# EAGLE design 2021_PWR_REVD (EAGLE 9.6.2)

## Sheet 1 of 5: Template
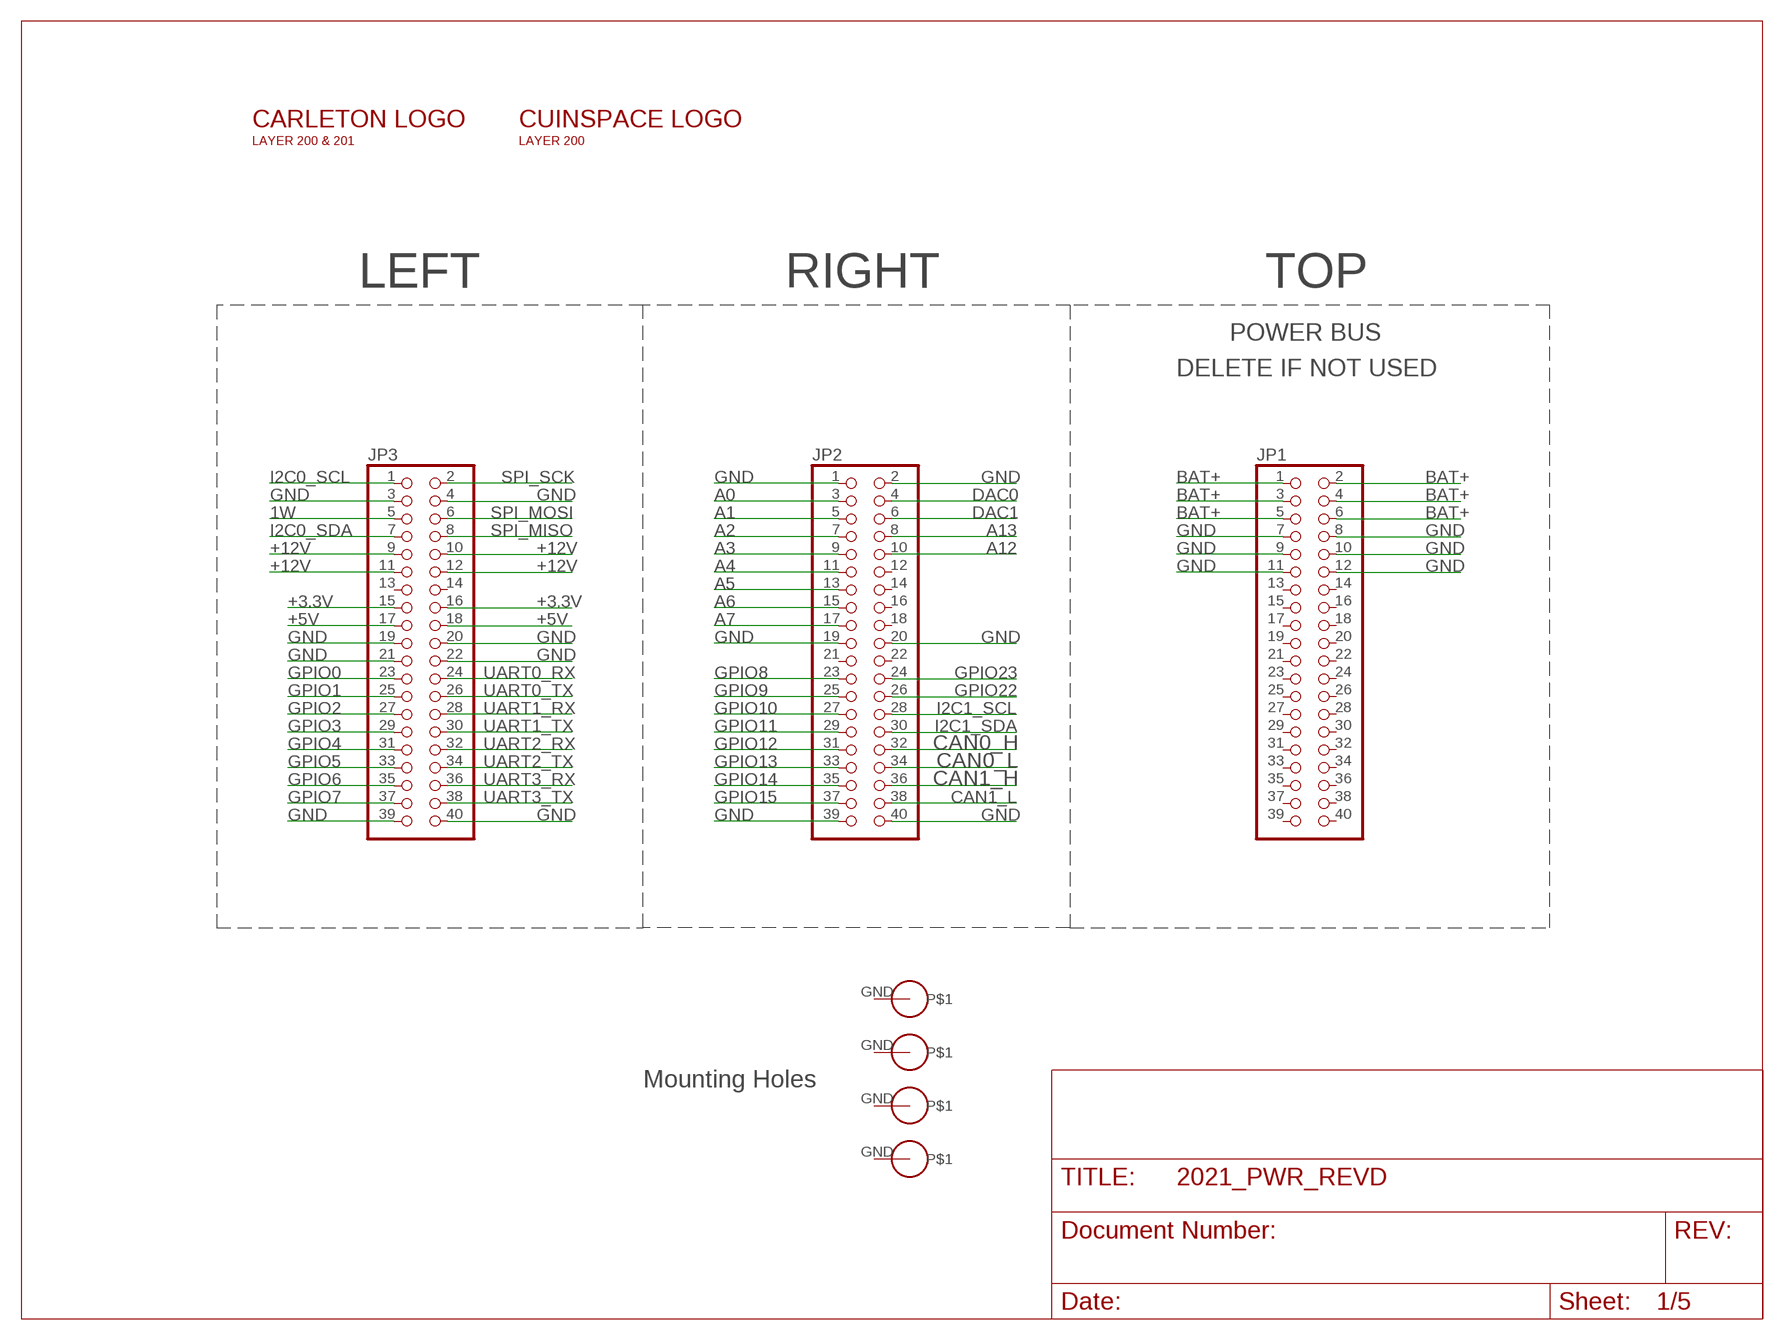
[diagram p0: schematic, sheet 1]

### Parts
$$U$1  PS/104-MOUNTING-HOLE  [PC/104-MOUNTING-HOLE]
JP1  PINHD-2X20  [2X20]
JP2  PINHD-2X20  [2X20]
JP3  PINHD-2X20  [2X20]
U$1  PS/104-MOUNTING-HOLE  [PC/104-MOUNTING-HOLE]
U$2  PS/104-MOUNTING-HOLE  [PC/104-MOUNTING-HOLE]
U$3  PS/104-MOUNTING-HOLE  [PC/104-MOUNTING-HOLE]
U$100  INSPACE3CM_L  [INSPACE_3CM_LETTERS]
U$101  CARLETON3CM  [CARLETONU_3CM]

### Nets
1W: JP3.5
+3.3V: JP3.15 JP3.16 ; also sheet 2,3
+5V: JP3.17 JP3.18 ; also sheet 2,3
+12V: JP3.9 JP3.10 JP3.11 JP3.12 ; also sheet 3
A0: JP2.3 ; also sheet 3
A1: JP2.5 ; also sheet 3
A2: JP2.7 ; also sheet 3
A3: JP2.9
A4: JP2.11
A5: JP2.13
A6: JP2.15
A7: JP2.17
A12: JP2.10
A13: JP2.8
BAT+: JP1.1 JP1.2 JP1.3 JP1.4 JP1.5 JP1.6 ; also sheet 2,3
CAN0_H: JP2.32
CAN0_L: JP2.34
CAN1_H: JP2.36
CAN1_L: JP2.38
DAC0: JP2.4
DAC1: JP2.6
GND [New Class]: JP1.7 JP1.8 JP1.9 JP1.10 JP1.11 JP1.12 JP2.1 JP2.2 JP2.19 JP2.20 JP2.39 JP2.40 JP3.3 JP3.4 JP3.19 JP3.20 JP3.21 JP3.22 JP3.39 JP3.40 ; also sheet 2,3
GPIO0: JP3.23
GPIO1: JP3.25
GPIO2: JP3.27
GPIO3: JP3.29
GPIO4: JP3.31
GPIO5: JP3.33
GPIO6: JP3.35
GPIO7: JP3.37
GPIO8: JP2.23
GPIO9: JP2.25
GPIO10: JP2.27
GPIO11: JP2.29
GPIO12: JP2.31 ; also sheet 3
GPIO13: JP2.33
GPIO14: JP2.35
GPIO15: JP2.37
GPIO22: JP2.26
GPIO23: JP2.24
I2C0_SCL: JP3.1
I2C0_SDA: JP3.7
I2C1_SCL: JP2.28
I2C1_SDA: JP2.30
SPI_MISO: JP3.8
SPI_MOSI: JP3.6
SPI_SCK: JP3.2
UART0_RX: JP3.24
UART0_TX: JP3.26
UART1_RX: JP3.28
UART1_TX: JP3.30
UART2_RX: JP3.32
UART2_TX: JP3.34
UART3_RX: JP3.36
UART3_TX: JP3.38
Unconnected: $$U$1.GND JP1.13 JP1.14 JP1.15 JP1.16 JP1.17 JP1.18 JP1.19 JP1.20 JP1.21 JP1.22 JP1.23 JP1.24 JP1.25 JP1.26 JP1.27 JP1.28 JP1.29 JP1.30 JP1.31 JP1.32 JP1.33 JP1.34 JP1.35 JP1.36 JP1.37 JP1.38 JP1.39 JP1.40 JP2.12 JP2.14 JP2.16 JP2.18 JP2.21 JP2.22 JP3.13 JP3.14 U$1.GND U$2.GND U$3.GND

### Notes on the sheet
- LEFT | RIGHT | TOP
- POWER BUS
- DELETE IF NOT USED
- Mounting Holes

## Sheet 2 of 5
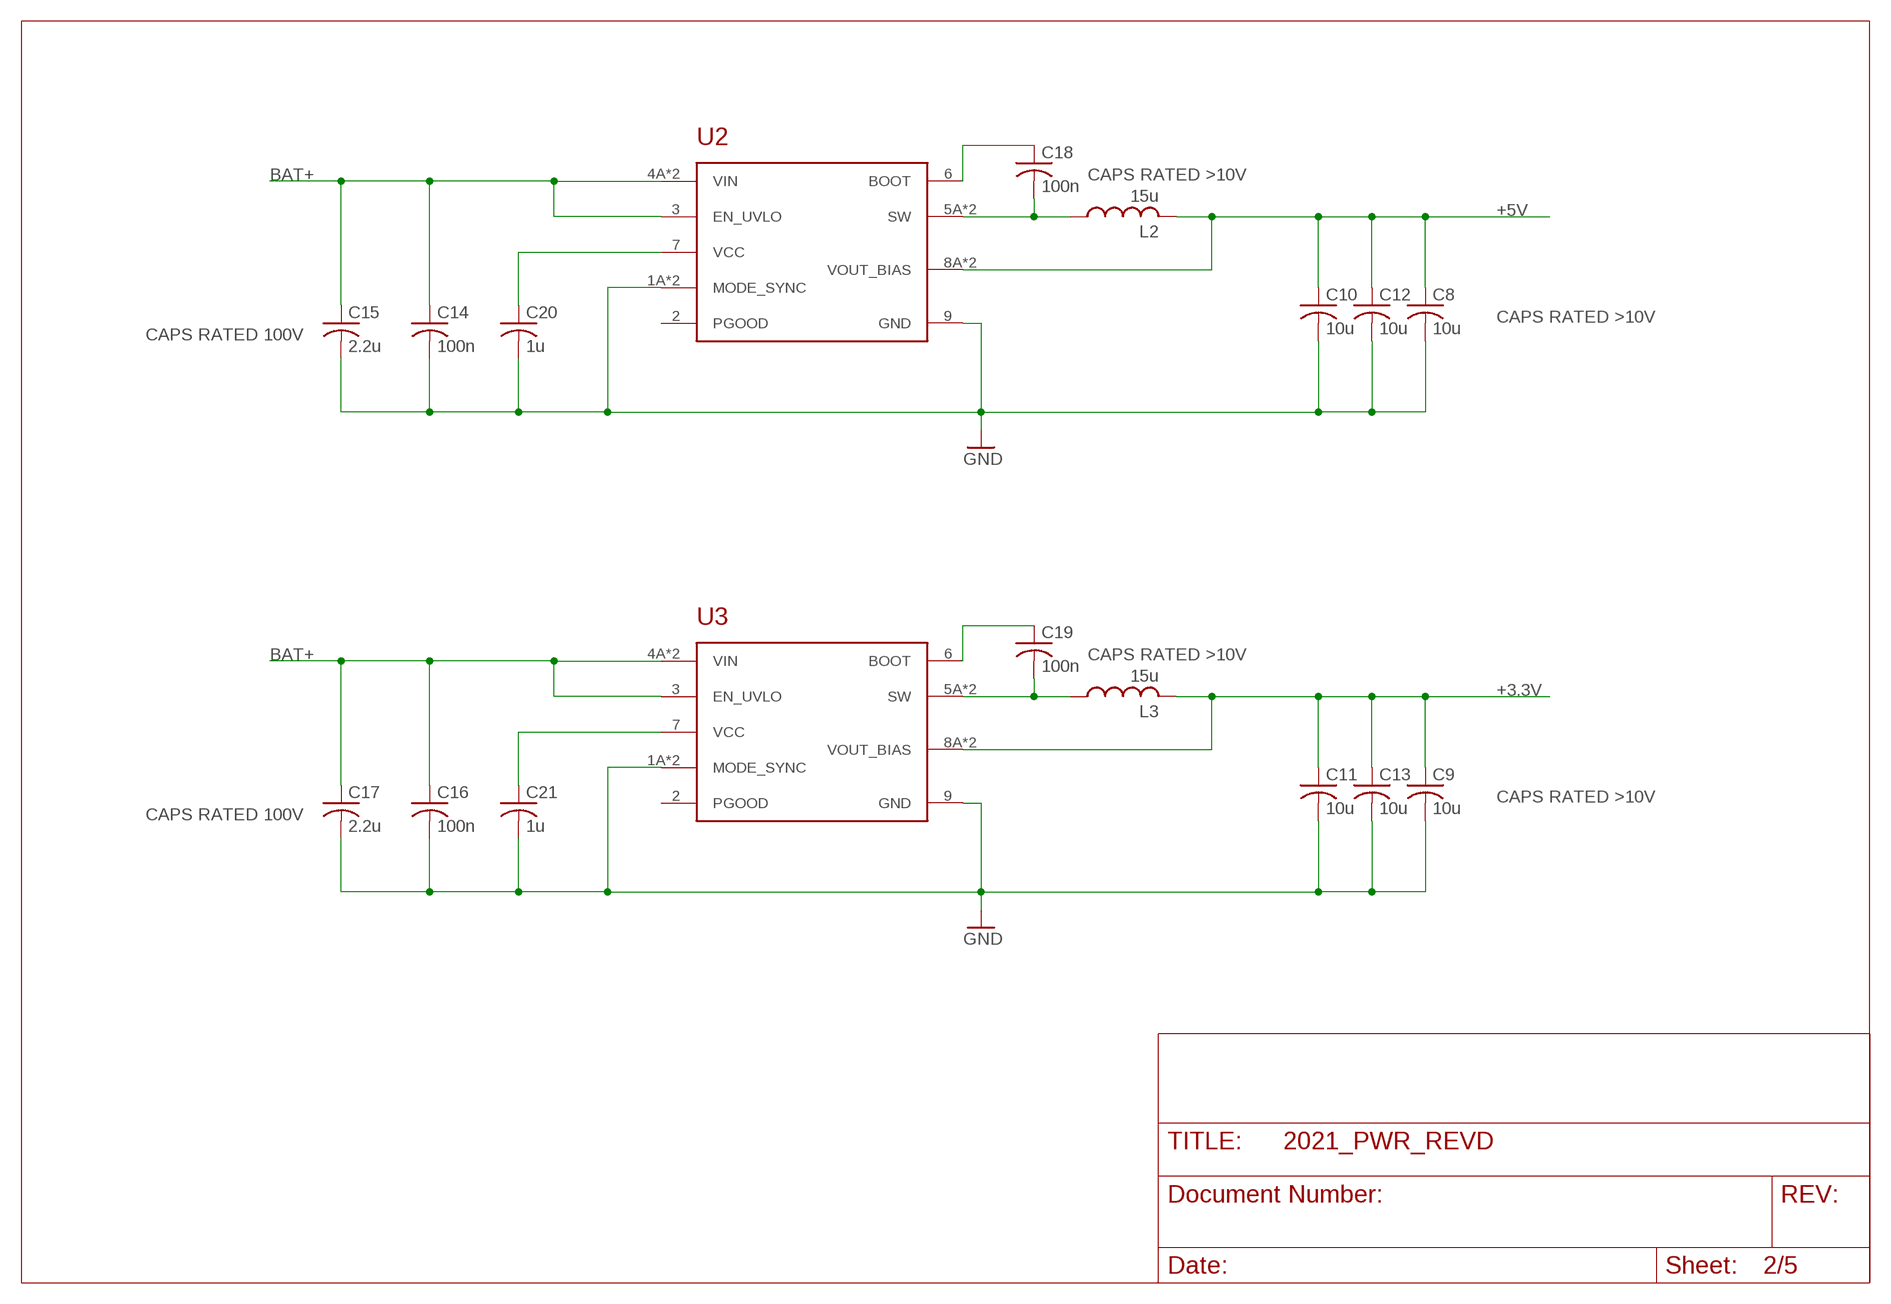
[diagram p1: schematic, sheet 2]

### Parts
C8  10u  C-USC0805  [C0805]
C9  10u  C-USC0805  [C0805]
C10  10u  C-USC0805  [C0805]
C11  10u  C-USC0805  [C0805]
C12  10u  C-USC0805  [C0805]
C13  10u  C-USC0805  [C0805]
C14  100n  C-USC0805  [C0805]
C15  2.2u  C-USC0805  [C0805]
C16  100n  C-USC0805  [C0805]
C17  2.2u  C-USC0805  [C0805]
C18  100n  C-USC0805  [C0805]
C19  100n  C-USC0805  [C0805]
C20  1u  C-USC0805  [C0805]
C21  1u  C-USC0805  [C0805]
L2  15u  IND_15UH_9A_28MOHMSRP1265A-150M  [13.5X12.5]
L3  15u  IND_15UH_9A_28MOHMSRP1265A-150M  [13.5X12.5]
U2  LMR36506LMR36506MSC3  [9-VFQFN]
U3  LMR36506LMR36506MSC3  [9-VFQFN]

### Nets
+3.3V: C9.1 C11.1 C13.1 L3.P$2 U3.8A(VOUT_BIAS) U3.8B(VOUT_BIAS) ; also sheet 1,3
+5V: C8.1 C10.1 C12.1 L2.P$2 U2.8A(VOUT_BIAS) U2.8B(VOUT_BIAS) ; also sheet 1,3
BAT+: C14.1 C15.1 C16.1 C17.1 U2.3(EN_UVLO) U2.4A(VIN) U2.4B(VIN) U3.3(EN_UVLO) U3.4A(VIN) U3.4B(VIN) ; also sheet 1,3
GND [New Class]: C8.2 C9.2 C10.2 C11.2 C12.2 C13.2 C14.2 C15.2 C16.2 C17.2 C20.2 C21.2 U2.1A(MODE_SYNC) U2.1B(MODE_SYNC) U2.9(GND) U3.1A(MODE_SYNC) U3.1B(MODE_SYNC) U3.9(GND) ; also sheet 1,3
N$3: C18.1 U2.6(BOOT)
N$4: C18.2 L2.P$1 U2.5A(SW) U2.5B(SW)
N$6: C20.1 U2.7(VCC)
N$10: C19.1 U3.6(BOOT)
N$11: C19.2 L3.P$1 U3.5A(SW) U3.5B(SW)
N$12: C21.1 U3.7(VCC)
Unconnected: U2.2(PGOOD) U3.2(PGOOD)

### Notes on the sheet
- CAPS RATED >10V
- CAPS RATED >10V
- CAPS RATED 100V
- CAPS RATED >10V
- CAPS RATED >10V
- CAPS RATED 100V

## Sheet 3 of 5
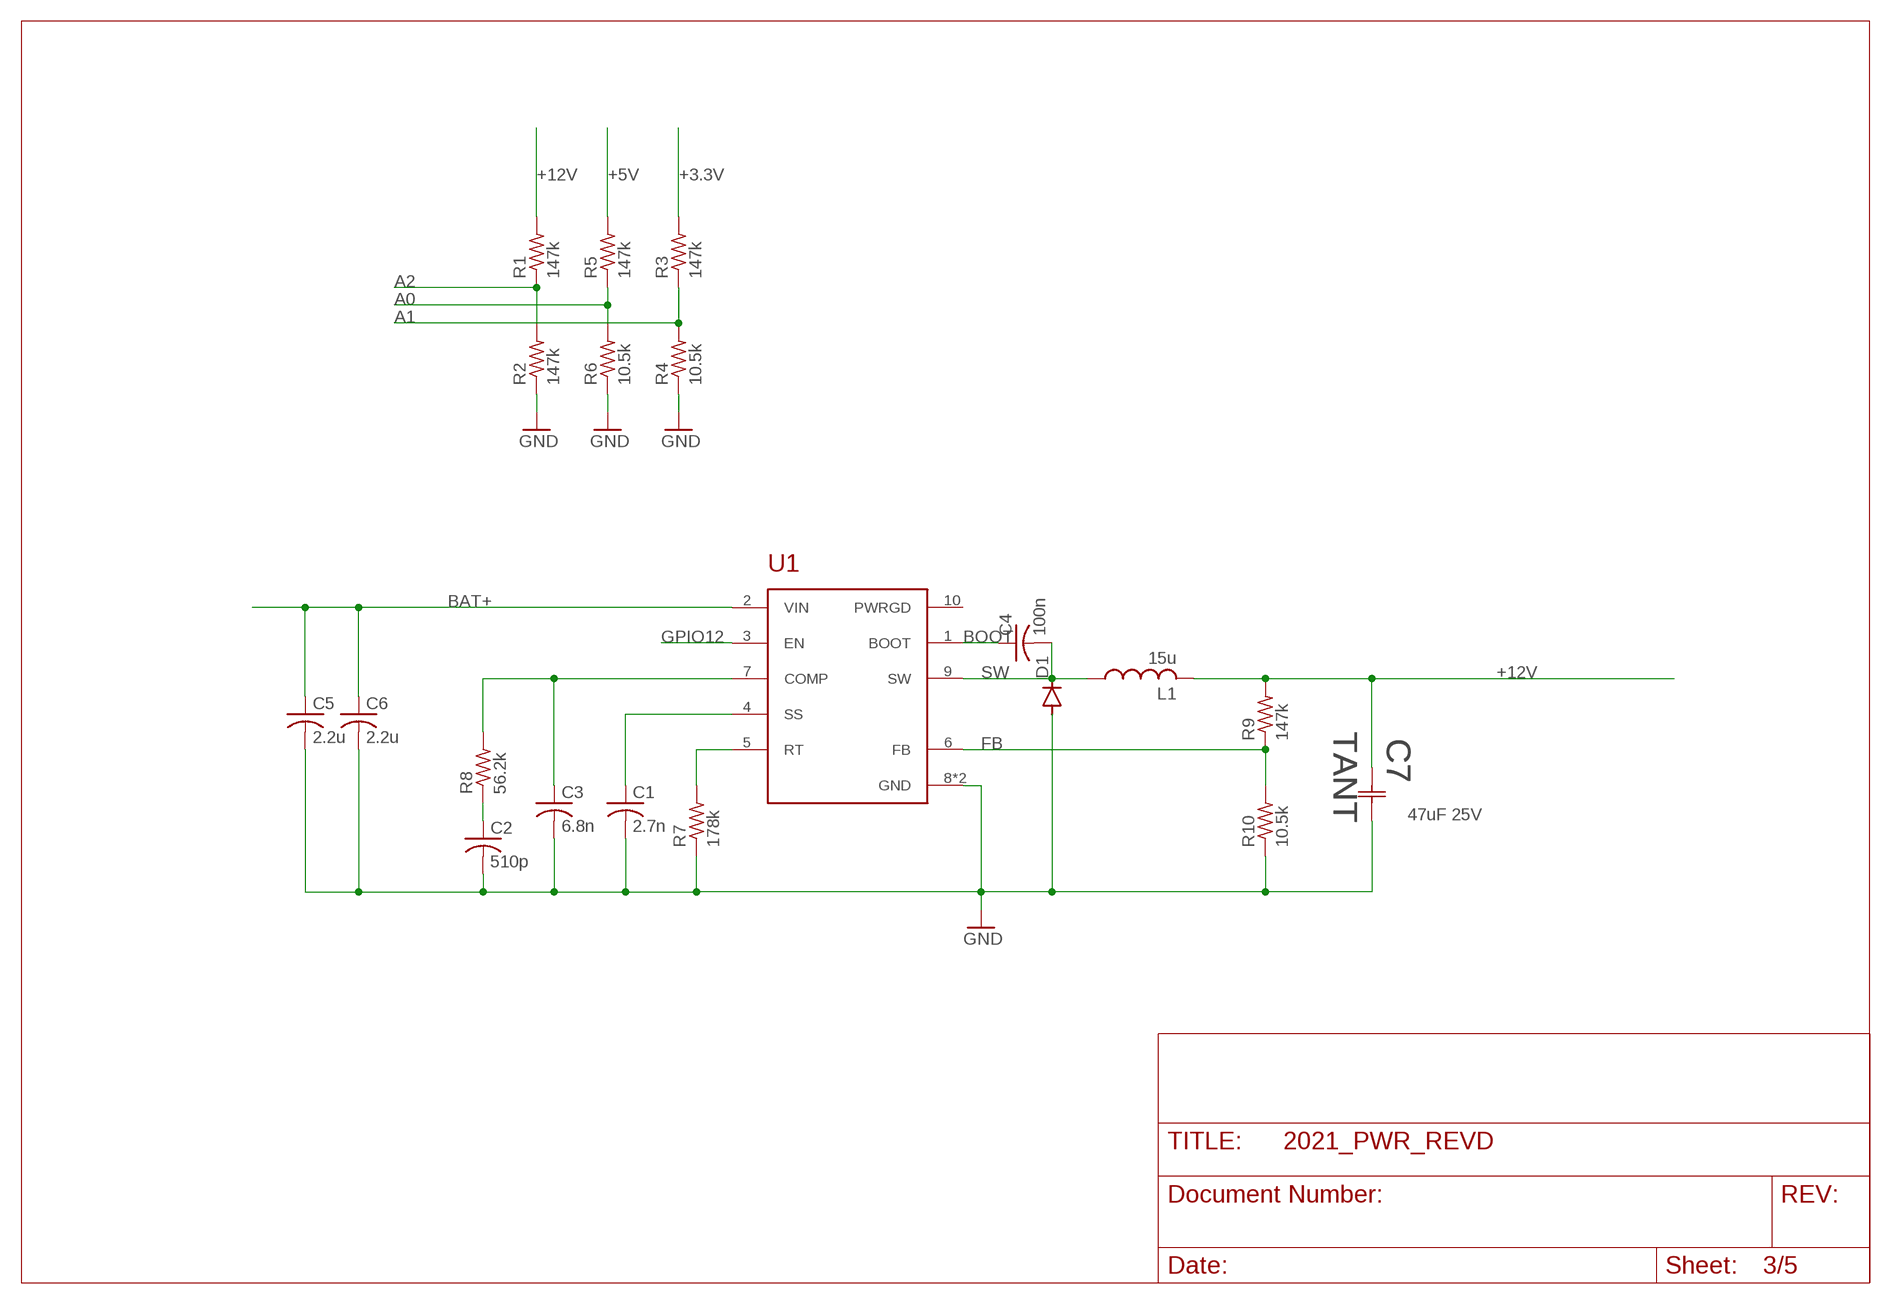
[diagram p2: schematic, sheet 3]

### Parts
C1  2.7n  C-USC0805  [C0805]
C2  510p  C-USC0805  [C0805]
C3  6.8n  C-USC0805  [C0805]
C4  100n  C-USC0805  [C0805]
C5  2.2u  C-USC0805  [C0805]
C6  2.2u  C-USC0805  [C0805]
C7  TANT  [TAJD]
D1  SCH_DIODE_10A_100VFSV10100V  [TO-277-3]
L1  15u  IND_15UH_9A_28MOHMSRP1265A-150M  [13.5X12.5]
R1  147k  R-US_R0805  [R0805]
R2  147k  R-US_R0805  [R0805]
R3  147k  R-US_R0805  [R0805]
R4  10.5k  R-US_R0805  [R0805]
R5  147k  R-US_R0805  [R0805]
R6  10.5k  R-US_R0805  [R0805]
R7  178k  R-US_R0805  [R0805]
R8  56.2k  R-US_R0805  [R0805]
R9  147k  R-US_R0805  [R0805]
R10  10.5k  R-US_R0805  [R0805]
U1  TPS54561  [10-WSON]

### Nets
+3.3V: R3.2 ; also sheet 1,2
+5V: R5.2 ; also sheet 1,2
+12V: C7.1 L1.P$2 R1.2 R9.2 ; also sheet 1
A0: R5.1 R6.2 ; also sheet 1
A1: R3.1 R4.2 ; also sheet 1
A2: R1.1 R2.2 ; also sheet 1
BAT+: C5.1 C6.1 U1.2(VIN) ; also sheet 1,2
BOOT: C4.1 U1.1(BOOT)
FB: R9.1 R10.2 U1.6(FB)
GND [New Class]: C1.2 C2.2 C3.2 C5.2 C6.2 C7.2 D1.P$2(A) D1.P$3(A) R2.1 R4.1 R6.1 R7.1 R10.1 U1.8(GND) U1.11(GND) ; also sheet 1,2
GPIO12: U1.3(EN) ; also sheet 1
N$18: R7.2 U1.5(RT)
N$19: C2.1 R8.1
N$20: C3.1 R8.2 U1.7(COMP)
N$21: C1.1 U1.4(SS)
SW: C4.2 D1.P$1(C) L1.P$1 U1.9(SW)
Unconnected: U1.10(PWRGD)

### Notes on the sheet
- 47uF 25V

## Sheet 4 of 5

## Sheet 5 of 5

## Library data of the parts
$$U$1 U$1-U$3 = CU inSpace 2019 Parts:PS/104-MOUNTING-HOLE: Mounting hole for PC/104 board.
C1-C6 C8-C21 = rcl:C-US: CAPACITOR, American symbol; SPICEPREFIX: C
C7 = CUINSPACE_Managed:TANT; MANUFACTURER_PART_NUMBER: TAJD226K016RNJ; VENDOR: AVX Corporation
D1 = PWR:SCH_DIODE_10A_100V
JP1-JP3 = pinhead:PINHD-2X20: PIN HEADER
L1-L3 = PWR:IND_15UH_9A_28MOHM
R1-R10 = rcl:R-US_: RESISTOR, American symbol; SPICEPREFIX: R
U1 = PWR:TPS54561
U2 U3 = PWR:LMR36506
U$100 = Logos:INSPACE
U$101 = Logos:CARLETON

## Net classes
2 diff pairs: width 0.254 mm

## Board
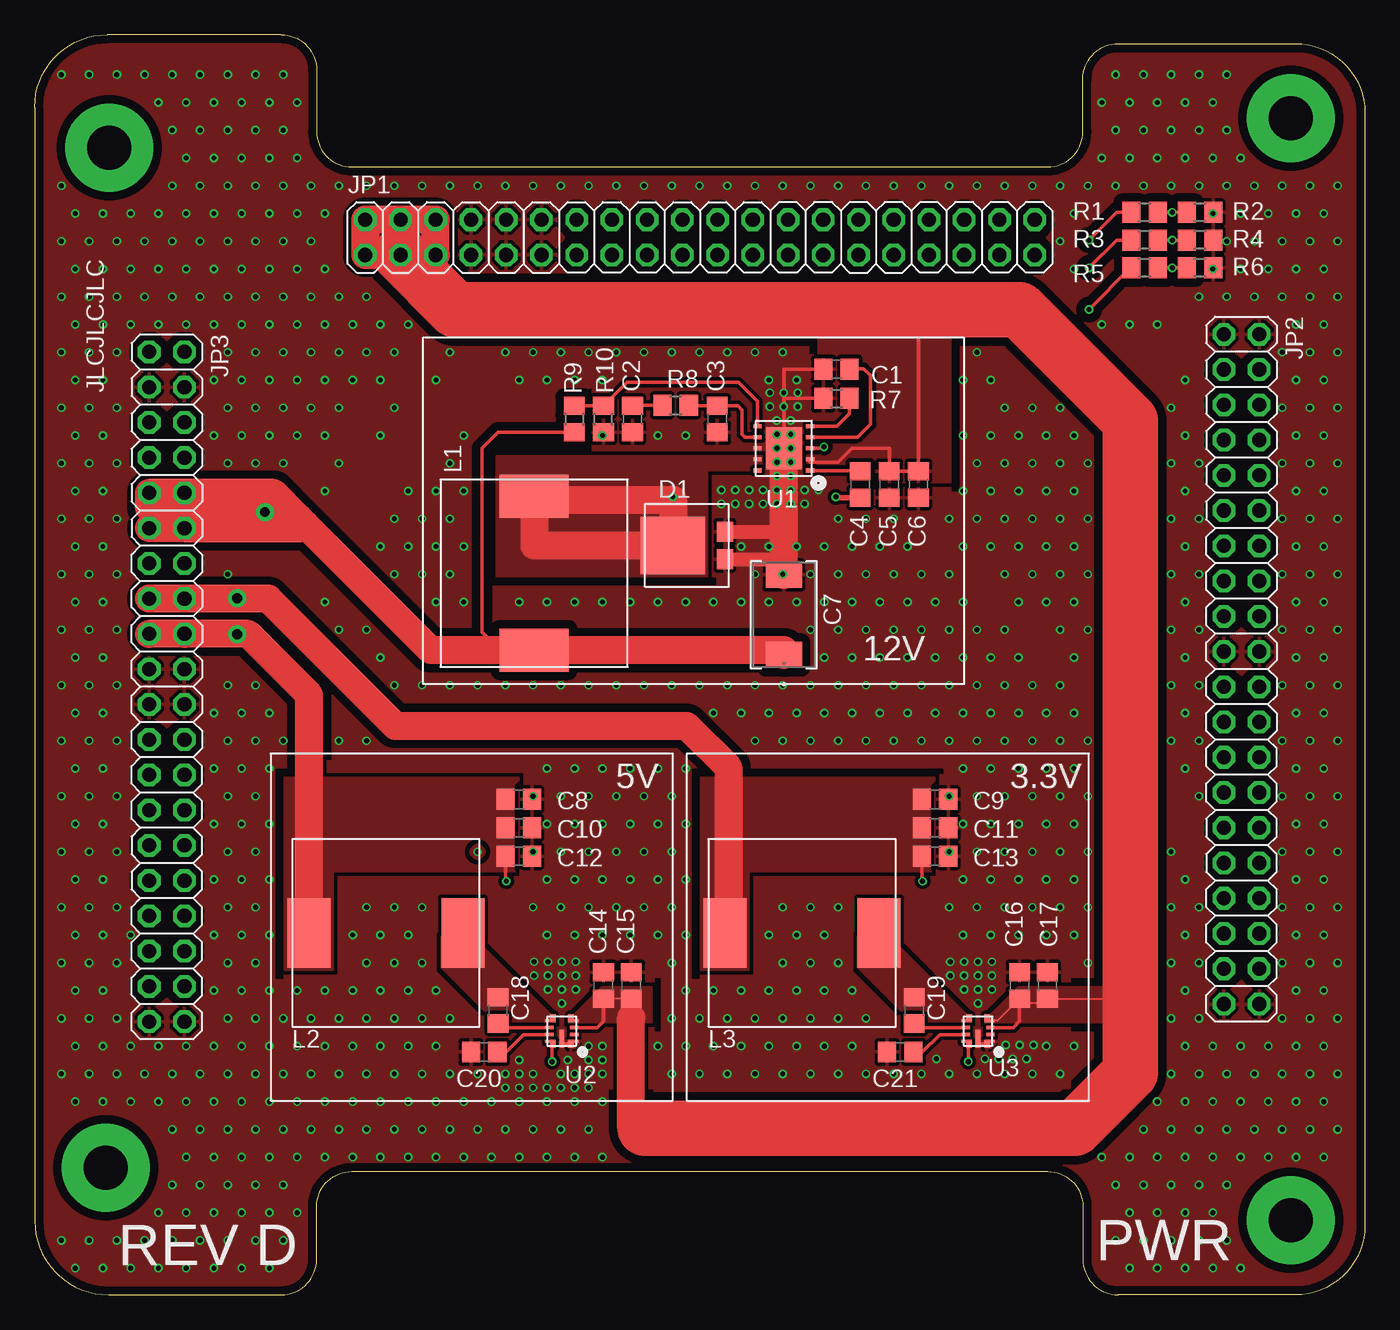
[diagram p3: board, top side]
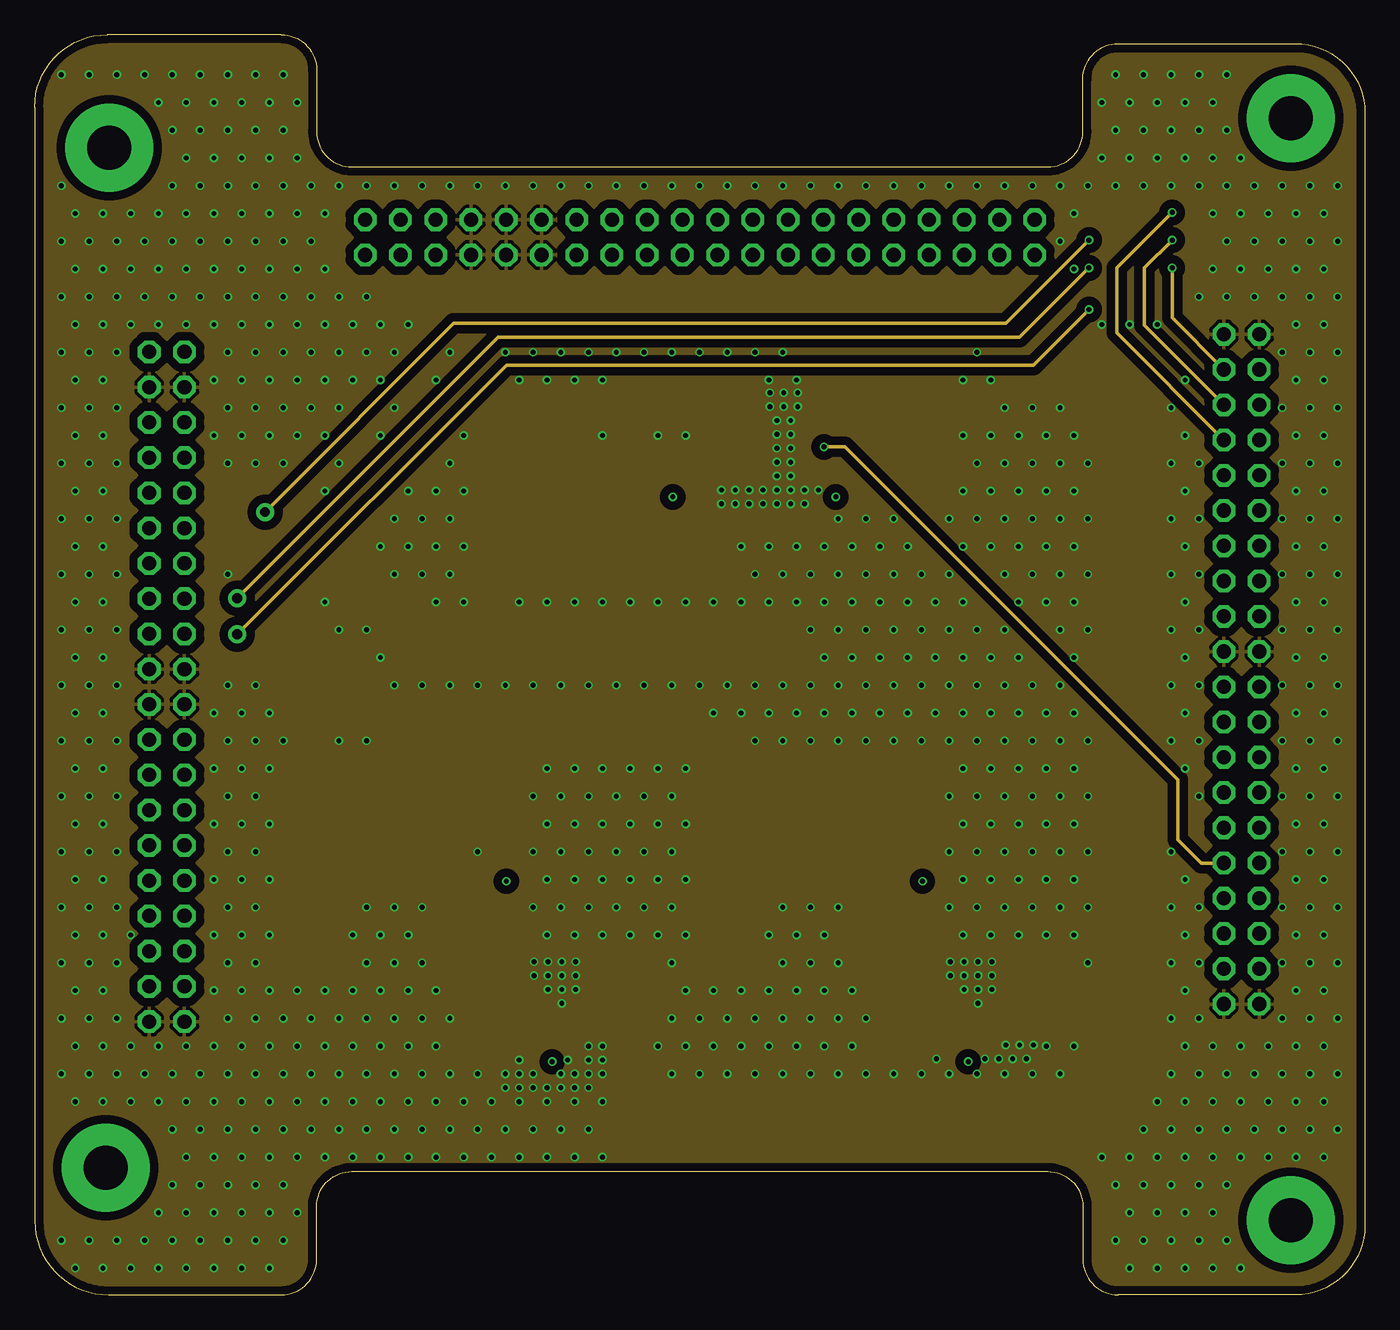
[diagram p4: board, inner layer Route2]
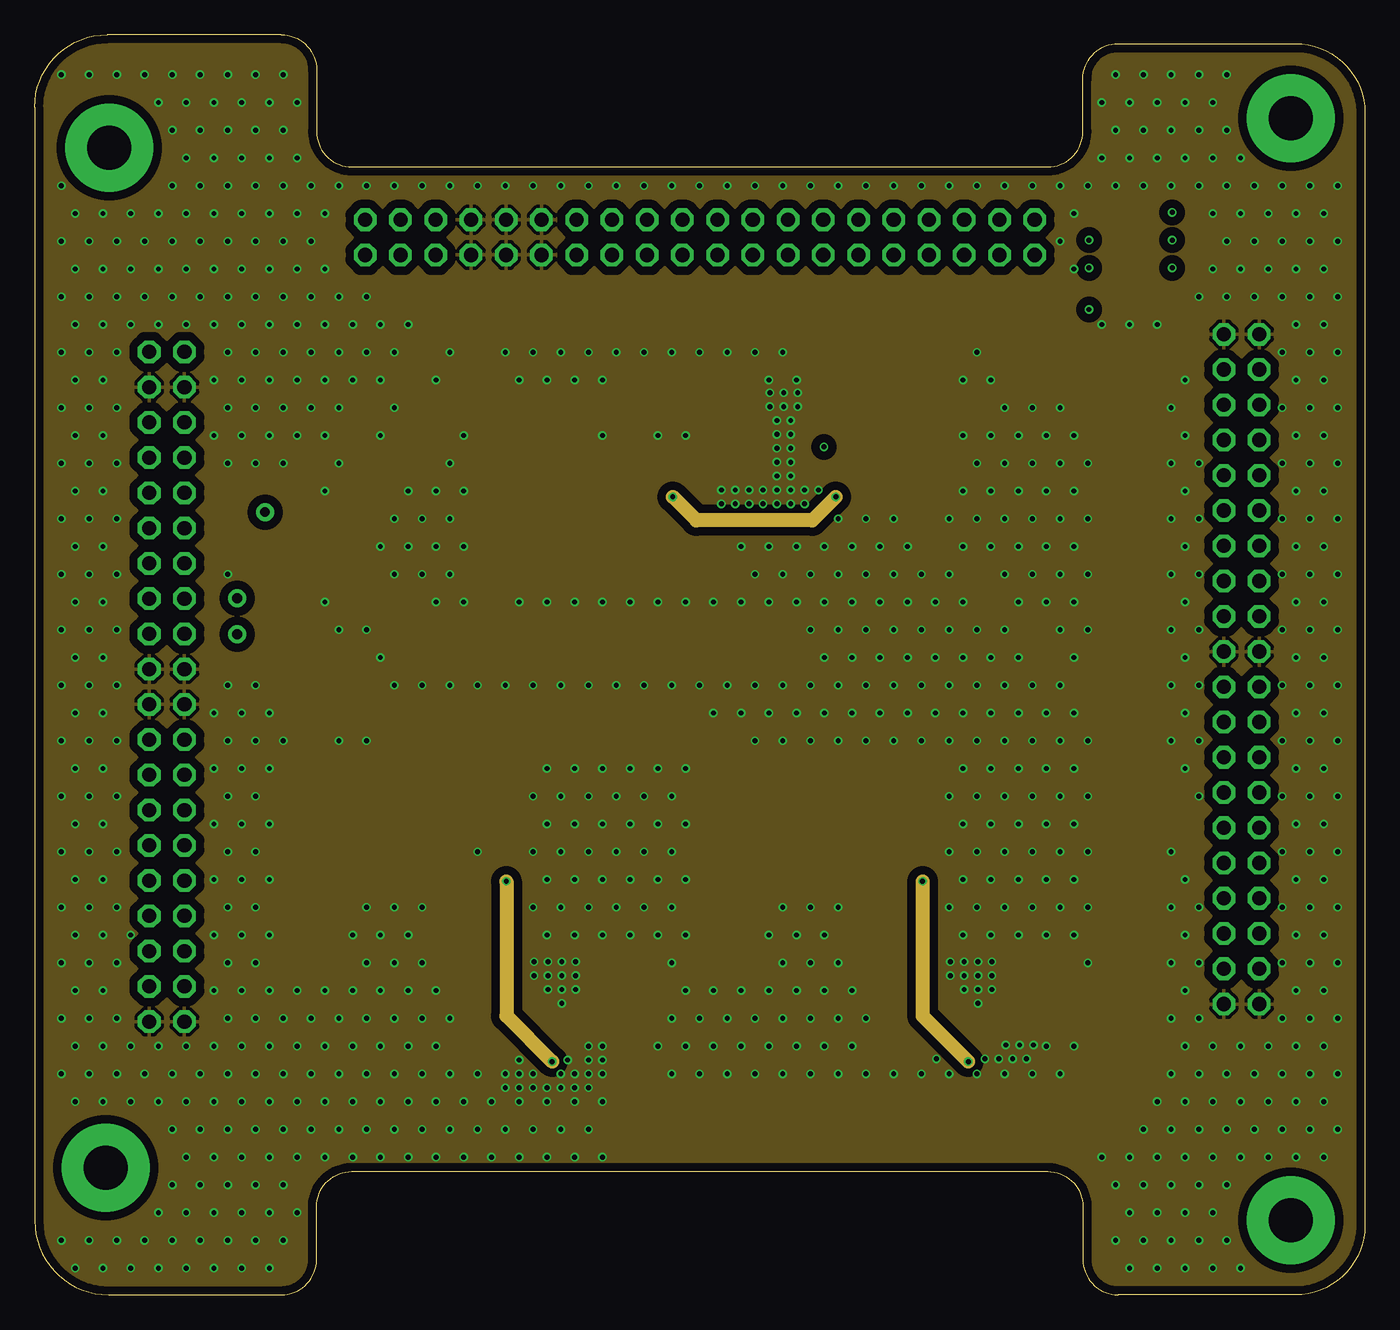
[diagram p5: board, inner layer Route15]
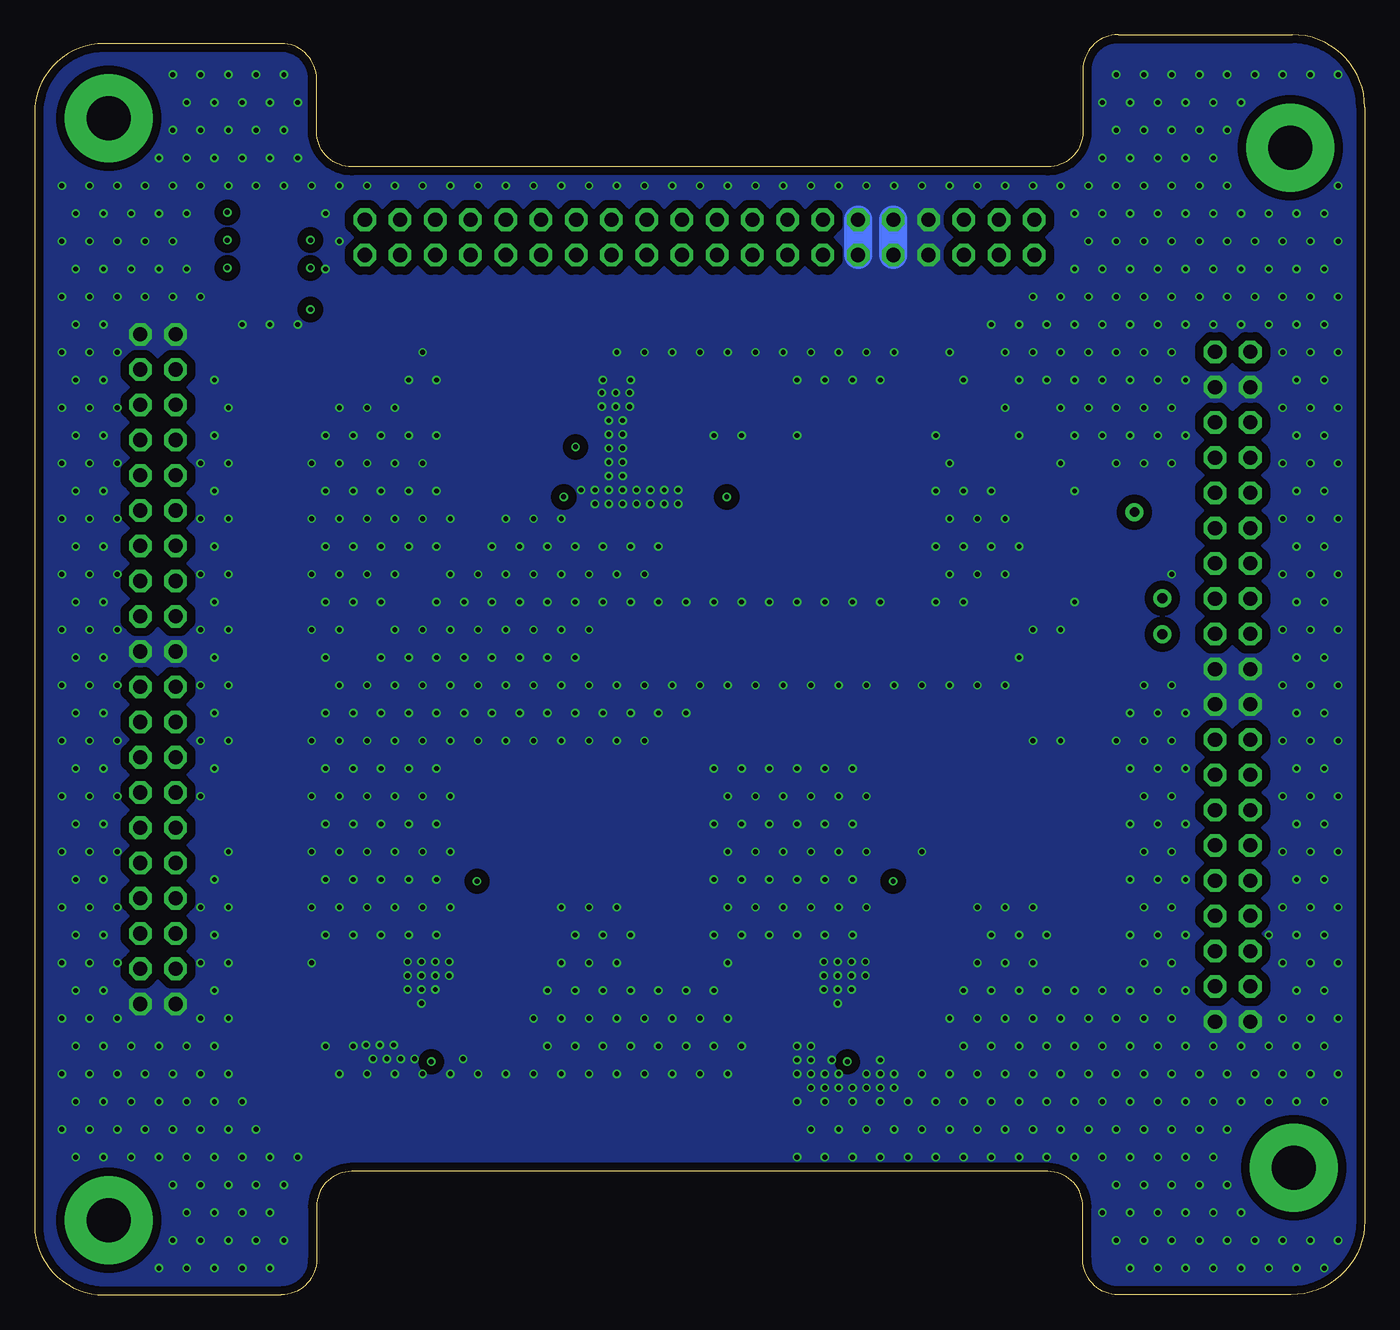
[diagram p6: board, bottom side, seen from below]

Size 95.89 x 90.81 mm. Coordinates in mm from the lower left corner, seen from the top.
Outline: 0,85.57 0,5.33 arc90 5.33,0 17.78,0 arc90 20.32,2.54 20.32,6.35 arc-90 22.86,8.89 73.03,8.89 arc-90 75.56,6.35 75.56,2.54 arc90 78.11,0 90.89,0 arc90 95.89,5 95.89,85.17 arc90 90.89,90.17 78.11,90.17 arc90 75.56,87.63 75.56,83.82 arc-90 73.03,81.28 22.86,81.28 arc-90 20.32,83.82 20.32,88.27 arc90 17.78,90.81 5.23,90.81 arc90 0,85.57
Copper layers (1+2*15+16): Top 0.035mm / dielectric 0.2mm / Route2 0.0175mm / dielectric 1.065mm / Route15 0.0175mm / dielectric 0.2mm / Bottom 0.035mm
Design rules "JLC 4 Layer *": minimum track width 5mil, minimum drill 0.2mm, track to track 3.5mil, track to pad 3.5mil, pad to pad 5mil, via to via 10mil, smd to smd 0mil, copper to edge 10mil, drill to drill 10mil, minimum pad ring 12mil, minimum via ring 5mil, stop-mask expansion 4mil, vias tented up to drill 0.4mm, thermal gap 10mil

### Footprints (pad centres in the part's own frame; a part is rotated, then mirrored left to right if it is on the bottom)
PC/104-MOUNTING-HOLE = drill 3.175 pad 6.35: GND 0,0
C0805 = smd 1.3 x 1.5: 1 -0.95,0; 2 0.95,0
TAJD = smd 1.88 x 2.591: 1 -2.883,0; 2 2.883,0
TO-277-3 = smd 4.65 x 4.15: P$1 -1,0 | smd 1.15 x 1.45: P$2 2.75,0.985; P$3 2.75,-0.985
2X20 = drill 1.016 octagon: 1 -24.13,-1.27; 2 -24.13,1.27; 3 -21.59,-1.27; 4 -21.59,1.27; 5 -19.05,-1.27; 6 -19.05,1.27; 7 -16.51,-1.27; 8 -16.51,1.27; 9 -13.97,-1.27; 10 -13.97,1.27; 11 -11.43,-1.27; 12 -11.43,1.27; 13 -8.89,-1.27; 14 -8.89,1.27; 15 -6.35,-1.27; 16 -6.35,1.27; 17 -3.81,-1.27; 18 -3.81,1.27; 19 -1.27,-1.27; 20 -1.27,1.27; 21 1.27,-1.27; 22 1.27,1.27; 23 3.81,-1.27; 24 3.81,1.27; 25 6.35,-1.27; 26 6.35,1.27; 27 8.89,-1.27; 28 8.89,1.27; 29 11.43,-1.27; 30 11.43,1.27; 31 13.97,-1.27; 32 13.97,1.27; 33 16.51,-1.27; 34 16.51,1.27; 35 19.05,-1.27; 36 19.05,1.27; 37 21.59,-1.27; 38 21.59,1.27; 39 24.13,-1.27; 40 24.13,1.27
13.5X12.5 = smd 3.1 x 5: P$1 -5.55,0; P$2 5.55,0
R0805 = smd 1.3 x 1.5: 1 -0.95,0; 2 0.95,0
10-WSON = smd 0.6 x 0.3: 1 -1.9,1.6; 2 -1.9,0.8; 3 -1.9,0; 4 -1.9,-0.8; 5 -1.9,-1.6; 6 1.9,-1.6; 7 1.9,-0.8; 8 1.9,0; 9 1.9,0.8; 10 1.9,1.6 | smd 2.6 x 3: 11 0,0
9-VFQFN = smd 0.6 x 0.225: 1A -0.9,0.738; 4A -0.9,-0.738; 5A 0.9,-0.738; 8A 0.9,0.738 | smd 0.4 x 0.575: 1B -0.65,0.913; 4B -0.65,-0.913; 5B 0.65,-0.913; 8B 0.65,0.913 | smd 0.6 x 0.25: 2 -0.9,0.25; 3 -0.9,-0.25; 6 0.9,-0.25; 7 0.9,0.25 | smd 0.35 x 1.3: 9 0,0.55

### Placement (x,y rotation side)
$$U$1  5.13,9.17 0 top
C1  57.8,66.7 180 top
C2  43.1,63.1 270 top
C3  49.2,63.1 270 top
C4  59.51,58.4 270 top
C5  61.6,58.4 270 top
C6  63.7,58.4 270 top
C7  54,49 90 top
C8  34.9,35.7 0 top
C9  64.9,35.7 0 top
C10  34.9,33.66 0 top
C11  64.9,33.66 0 top
C12  34.9,31.6 0 top
C13  64.9,31.6 0 top
C14  41,22.3 90 top
C15  43,22.3 90 top
C16  71,22.3 90 top
C17  73,22.3 90 top
C18  33.4,20.5 90 top
C19  63.4,20.5 90 top
C20  32.4,17.5 180 top
C21  62.4,17.5 180 top
D1  47,54 0 top
JP1  47.96,76.2 0 top
JP2  87,45.09 270 top
JP3  9.53,43.81 270 top
L1  36,52 270 top
L2  25.32,26.08 180 top
L3  55.32,26.08 180 top
R1  80,78 180 top
R2  84,78 180 top
R3  80,76 180 top
R4  84,76 180 top
R5  80,74 180 top
R6  84,74 180 top
R7  57.8,64.6 0 top
R8  46.2,64.1 0 top
R9  38.9,63.1 270 top
R10  41,63.1 90 top
U1  54,61 180 top
U2  38,19 180 top
U3  68,19 180 top
U$1  90.55,84.79 0 top
U$2  5.36,82.65 0 top
U$3  90.55,5.36 0 top
U$100  62.99,37.93 0 bottom
U$101  62.6,43.9 0 bottom

### Tracks (layer width: path | path; a pad name or v marks a point on that pad's centre or on a via)
+3.3V  (via drill 0.35, 0.7 pad 1.3)
  Top 0.15: U3.8B 67.28,18.09 U3.8A
  Top 0.152: v14.6,50.2 10.83,50.2 JP3.16
  Top 0.254: v76,74 78,76 R3.2
  Top 0.256: C13.1 63.95,29.85 v64,29.8 | v67.3,16.8 67.3,18.04 U3.8B
  Top 2: JP3.15 JP3.16 16.84,50.16 26,41 47,41 50,38 50,26
  Route2 0.254: v14.6,50.2 33.4,69 71,69 v76,74
  Route15 1.016: v64,29.8 64,20.1 v67.3,16.8
  pour Top (isolate 0.61, no thermals): 51.5,30.5 51.5,23.4 48,23.4 48,37.3 64.9,37.3 64.9,30.5
+5V  (via drill 0.35, 0.7 pad 1.3)
  Top 0.15: U2.8B 37.17,18.26 U2.8A
  Top 0.152: v14.6,47.6 8.28,47.6 JP3.17
  Top 0.254: v76,71 79,74 R5.2
  Top 0.256: C12.1 33.95,29.85 v34,29.8 | v37.3,16.8 37.3,18.04 U2.8B
  Top 2: L2.P$2 19.77,43.23 15.38,47.62 JP3.18 JP3.17
  Route2 0.254: v14.6,47.6 34,67 72,67 v76,71
  Route15 1.016: v34,29.8 34,20.1 v37.3,16.8
  pour Top (isolate 0.61, no thermals): 21.5,30.5 21.5,23.4 18,23.4 18,37.3 34.9,37.3 34.9,30.5
+12V  (via drill 0.35, 0.7 pad 1.3)
  Top 0.152: v16.6,56.4 12.18,56.4 JP3.10
  Top 0.254: v76,76 78,78 R1.2
  Top 0.256: R9.2 33.4,62.15 32.25,61 32.25,47.75 33.55,46.45 35.75,46.45 L1.P$2
  Top 2: C7.1 54,46.45 35.75,46.45 28.55,46.45 19.5,55.5 | 19,56 17.21,57.78 JP3.10 JP3.9 8.26,56.74 9,56 19,56 | 19.5,55.5 19.25,55.24 JP3.12 JP3.11 | 19.5,55.5 19,56
  Route2 0.254: v16.6,56.4 30.2,70 70,70 v76,76
A0  (via drill 0.35)
  Top 0.254: R5.1 v82,74 R6.2
  Route2 0.254: v82,74 82,70.4 JP2.3
A1  (via drill 0.35)
  Top 0.254: R3.1 v82,76 R4.2
  Route2 0.254: v82,76 80,74 80,69.86 JP2.5
A2  (via drill 0.35)
  Top 0.254: R1.1 v82,78 R2.2
  Route2 0.254: v82,78 78,74 78,69.32 JP2.7
BAT+
  Top 0.15: 43,20 C15.1 C14.1 | C17.1 72.65,21 71,21 | C16.1 69.39,19.74 U3.4A 68.72,19.91 U3.4B
  Top 0.152: C17.1 78.65,21.35 79,21
  Top 0.254: 62,71 63.7,71 C6.1 C5.1 61.6,61 58.9,61 57.9,60 55.9,60 U1.2
  Top 0.256: U2.3 40.55,19.25 41,19.7 C14.1 | U3.3 70.55,19.25 71,19.7 71,21 C16.1
  Top 2: 43,20 43,12 46,12 | JP1.2 JP1.1 JP1.3 JP1.5 JP1.6 JP1.4 JP1.2
  Top 4: JP1.3 30.3,71 62,71 71,71 79,63 79,21 79,16 75,12 46,12 44,12
  pour Top (isolate 0.305): 66,58.5 60.25,58.5 60.25,59.5 55.25,59.5 55.25,61 56.5,61 56.5,70.75 66,70.75
  pour Top (isolate 0.254, no thermals): 38.5,19.6 44.5,19.6 44.5,22.2 40.9,22.2 38.5,19.8
  pour Top (isolate 0.254, no thermals): 68.5,19.6 78.5,19.6 78.5,22.2 70.9,22.2 68.5,19.8
BOOT
  Top 0.256: U1.1 59.51,59.4 C4.1
FB
  Top 0.256: R9.1 R10.2 42.7,65.75 50.75,65.75 52.1,64.4 U1.6
GND  (via drill 0.35)
  Top 0.254: C1.2 54,66.7 54,64.6 | 54,64.6 U1.11 | R7.1 54,64.6
  Top 0.256: U2.1B 38,18.09 U2.9 | U3.1B 68,18.09 U3.9
  Top 1: D1.P$3 54,53.02 54,53 | D1.P$2 54,54.98 54,55
  Top 2: C7.2 54,53 54,55 U1.11
  Bottom 2: JP1.9 JP1.10 | JP1.12 JP1.11
  other vias: 2.92,1.92 1.92,3.92 2.92,13.92 1.92,15.92 2.92,17.92 1.92,19.92 2.92,21.92 1.92,23.92 2.92,25.92 1.92,27.92 2.92,29.92 1.92,31.92 2.92,33.92 1.92,35.92 2.92,37.92 1.92,39.92 2.92,41.92 1.92,43.92 2.92,45.92 1.92,47.92 2.92,49.92 1.92,51.92 2.92,53.92 1.92,55.92 2.92,57.92 1.92,59.92 2.92,61.92 1.92,63.92 2.92,65.92 1.92,67.92 2.92,69.92 1.92,71.92 2.92,73.92 1.92,75.92 2.92,77.92 1.92,79.92 1.92,87.92 4.92,1.92 3.92,3.92 4.92,13.92 3.92,15.92 4.92,17.92 3.92,19.92 4.92,21.92 3.92,23.92 4.92,25.92 3.92,27.92 4.92,29.92 3.92,31.92 4.92,33.92 3.92,35.92 4.92,37.92 3.92,39.92 4.92,41.92 3.92,43.92 4.92,45.92 3.92,47.92 4.92,49.92 3.92,51.92 4.92,53.92 3.92,55.92 4.92,57.92 3.92,59.92 4.92,61.92 3.92,63.92 4.92,65.92 3.92,67.92 4.92,69.92 3.92,71.92 4.92,73.92 3.92,75.92 4.92,77.92 3.92,87.92 6.92,1.92 5.92,3.92 6.92,13.92 5.92,15.92 6.92,17.92 5.92,19.92 5.92,23.92 6.92,25.92 5.92,27.92 5.92,31.92 5.92,35.92 5.92,39.92 5.92,43.92 5.92,47.92 5.92,51.92 5.92,55.92 5.92,59.92 5.92,63.92 5.92,67.92 6.92,69.92 5.92,71.92 6.92,73.92 5.92,75.92 6.92,77.92 5.92,87.92 8.92,1.92 7.92,3.92 8.92,5.92 8.92,13.92 7.92,15.92 8.92,17.92 8.92,69.92 7.92,71.92 8.92,73.92 7.92,75.92 8.92,77.92 8.92,85.92 7.92,87.92 10.92,1.92 9.92,3.92 10.92,5.92 9.92,7.92 10.92,9.92 9.92,11.92 10.92,13.92 9.92,15.92 10.92,17.92 10.92,69.92 9.92,71.92 10.92,73.92 9.92,75.92 10.92,77.92 9.92,79.92 10.92,81.92 9.92,83.92 10.92,85.92 9.92,87.92 12.92,1.92 11.92,3.92 12.92,5.92 11.92,7.92 12.92,9.92 11.92,11.92 12.92,13.92 11.92,15.92 12.92,17.92 12.92,21.92 12.92,25.92 12.92,29.92 12.92,33.92 12.92,37.92 12.92,41.92 12.92,61.92 12.92,65.92 12.92,69.92 11.92,71.92 12.92,73.92 11.92,75.92 12.92,77.92 11.92,79.92 12.92,81.92 11.92,83.92 12.92,85.92 11.92,87.92 14.92,1.92 13.92,3.92 14.92,5.92 13.92,7.92 14.92,9.92 13.92,11.92 14.92,13.92 13.92,15.92 14.92,17.92 13.92,19.92 14.92,21.92 13.92,23.92 14.92,25.92 13.92,27.92 14.92,29.92 13.92,31.92 14.92,33.92 13.92,35.92 14.92,37.92 13.92,39.92 14.92,41.92 13.92,43.92 13.92,51.92 13.92,59.92 14.92,61.92 13.92,63.92 14.92,65.92 13.92,67.92 14.92,69.92 13.92,71.92 14.92,73.92 13.92,75.92 14.92,77.92 13.92,79.92 14.92,81.92 13.92,83.92 14.92,85.92 13.92,87.92 16.92,1.92 15.92,3.92 16.92,5.92 15.92,7.92 16.92,9.92 15.92,11.92 16.92,13.92 15.92,15.92 16.92,17.92 15.92,19.92 16.92,21.92 15.92,23.92 16.92,25.92 15.92,27.92 16.92,29.92 15.92,31.92 16.92,33.92 15.92,35.92 16.92,37.92 15.92,39.92 16.92,41.92 15.92,43.92 15.92,59.92 16.92,61.92 15.92,63.92 16.92,65.92 15.92,67.92 16.92,69.92 15.92,71.92 16.92,73.92 15.92,75.92 16.92,77.92 15.92,79.92 16.92,81.92 15.92,83.92 16.92,85.92 15.92,87.92 17.92,3.92 18.92,5.92 17.92,7.92 18.92,9.92 17.92,11.92 18.92,13.92 17.92,15.92 18.92,17.92 17.92,19.92 18.92,21.92 17.92,39.92 17.92,59.92 18.92,61.92 17.92,63.92 18.92,65.92 17.92,67.92 18.92,69.92 17.92,71.92 18.92,73.92 17.92,75.92 18.92,77.92 17.92,79.92 18.92,81.92 17.92,83.92 18.92,85.92 17.92,87.92 20.92,9.92 19.92,11.92 20.92,13.92 19.92,15.92 20.92,17.92 19.92,19.92 20.92,21.92 20.92,49.92 20.92,57.92 20.92,61.92 19.92,63.92 20.92,65.92 19.92,67.92 20.92,69.92 19.92,71.92 20.92,73.92 19.92,75.92 20.92,77.92 19.92,79.92 22.92,9.92 21.92,11.92 22.92,13.92 21.92,15.92 22.92,17.92 21.92,19.92 22.92,21.92 22.92,25.92 21.92,39.92 21.92,47.92 21.92,59.92 21.92,63.92 22.92,65.92 21.92,67.92 22.92,69.92 21.92,71.92 21.92,79.92 24.92,9.92 23.92,11.92 24.92,13.92 23.92,15.92 24.92,17.92 23.92,19.92 24.92,21.92 23.92,23.92 24.92,25.92 23.92,27.92 23.92,39.92 24.92,45.92 23.92,47.92 24.92,53.92 24.92,61.92 24.92,65.92 23.92,67.92 24.92,69.92 23.92,71.92 23.92,79.92 26.92,9.92 25.92,11.92 26.92,13.92 25.92,15.92 26.92,17.92 25.92,19.92 26.92,21.92 25.92,23.92 26.92,25.92 25.92,27.92 25.92,43.92 25.92,51.92 26.92,53.92 25.92,55.92 26.92,57.92 25.92,63.92 25.92,67.92 26.92,69.92 25.92,79.92 28.92,9.92 27.92,11.92 28.92,13.92 27.92,15.92 28.92,17.92 27.92,19.92 28.92,21.92 27.92,23.92 27.92,27.92 27.92,43.92 28.92,49.92 27.92,51.92 28.92,53.92 27.92,55.92 28.92,57.92 28.92,65.92 27.92,79.92 30.92,9.92 29.92,11.92 30.92,13.92 29.92,15.92 29.92,19.92 29.92,43.92 30.92,49.92 29.92,51.92 30.92,53.92 29.92,55.92 30.92,57.92 29.92,59.92 30.92,61.92 29.92,67.92 29.92,79.92 32.92,9.92 31.92,11.92 32.92,13.92 31.92,15.92 31.92,31.92 31.92,43.92 31.92,79.92 34.92,9.92 33.92,11.92 34.92,13.92 33.92,15.92 33.92,43.92 34.92,49.92 34.92,65.92 33.92,67.92 33.92,79.92 36.92,9.92 35.92,11.92 36.92,13.92 35.92,15.92 36.92,25.92 35.92,27.92 36.92,29.92 35.92,31.92 36.92,33.92 35.92,35.92 36.92,37.92 35.92,43.92 36.92,49.92 36.92,65.92 35.92,67.92 35.92,79.92 38.92,9.92 37.92,11.92 38.92,13.92 37.92,15.92 38.92,25.92 37.92,27.92 38.92,29.92 37.92,31.92 38.92,33.92 37.92,35.92 38.92,37.92 37.92,43.92 38.92,49.92 38.92,65.92 37.92,67.92 37.92,79.92 40.92,9.92 39.92,11.92 40.92,13.92 39.92,15.92 40.92,17.92 40.92,25.92 39.92,27.92 40.92,29.92 39.92,31.92 40.92,33.92 39.92,35.92 40.92,37.92 39.92,43.92 40.92,49.92 40.92,61.92 40.92,65.92 39.92,67.92 39.92,79.92 42.92,25.92 41.92,27.92 42.92,29.92 41.92,31.92 42.92,33.92 41.92,35.92 42.92,37.92 41.92,43.92 42.92,49.92 41.92,67.92 41.92,79.92 44.92,17.92 44.92,25.92 43.92,27.92 44.92,29.92 43.92,31.92 44.92,33.92 43.92,35.92 44.92,37.92 43.92,43.92 44.92,49.92 44.92,61.92 43.92,67.92 43.92,79.92 45.92,15.92 46.92,17.92 45.92,19.92 46.92,21.92 45.92,23.92 46.92,25.92 45.92,27.92 46.92,29.92 45.92,31.92 46.92,33.92 45.92,35.92 46.92,37.92 45.92,43.92 46.92,49.92 46.92,61.92 45.92,67.92 45.92,79.92 47.92,15.92 48.92,17.92 47.92,19.92 48.92,21.92 48.92,41.92 47.92,43.92 48.92,49.92 47.92,67.92 47.92,79.92 49.92,15.92 50.92,17.92 49.92,19.92 50.92,21.92 50.92,41.92 49.92,43.92 50.92,49.92 50.92,53.92 49.92,67.92 49.92,79.92 51.92,15.92 52.92,17.92 51.92,19.92 52.92,21.92 52.92,25.92 51.92,39.92 52.92,41.92 51.92,43.92 52.92,49.92 51.92,51.92 52.92,53.92 52.92,65.92 51.92,67.92 51.92,79.92 53.92,15.92 54.92,17.92 53.92,19.92 54.92,21.92 53.92,23.92 54.92,25.92 53.92,27.92 53.92,39.92 54.92,41.92 53.92,43.92 54.92,49.92 53.92,51.92 54.92,53.92 54.92,65.92 53.92,67.92 53.92,79.92 55.92,15.92 56.92,17.92 55.92,19.92 56.92,21.92 55.92,23.92 56.92,25.92 55.92,27.92 55.92,39.92 56.92,41.92 55.92,43.92 56.92,45.92 55.92,47.92 56.92,49.92 55.92,51.92 56.92,53.92 55.92,79.92 57.92,15.92 58.92,17.92 57.92,19.92 58.92,21.92 57.92,23.92 57.92,27.92 57.92,39.92 58.92,41.92 57.92,43.92 58.92,45.92 57.92,47.92 58.92,49.92 57.92,51.92 58.92,53.92 57.92,55.92 57.92,79.92 59.92,15.92 59.92,19.92 59.92,39.92 60.92,41.92 59.92,43.92 60.92,45.92 59.92,47.92 60.92,49.92 59.92,51.92 60.92,53.92 59.92,55.92 59.92,79.92 61.92,15.92 61.92,39.92 62.92,41.92 61.92,43.92 62.92,45.92 61.92,47.92 62.92,49.92 61.92,51.92 62.92,53.92 61.92,55.92 61.92,79.92 63.92,15.92 63.92,39.92 64.92,41.92 63.92,43.92 64.92,45.92 63.92,47.92 64.92,49.92 63.92,51.92 63.92,79.92 65.92,15.92 66.92,25.92 65.92,27.92 66.92,29.92 65.92,31.92 66.92,33.92 65.92,35.92 66.92,37.92 65.92,39.92 66.92,41.92 65.92,43.92 66.92,45.92 65.92,47.92 66.92,49.92 65.92,51.92 66.92,53.92 65.92,55.92 66.92,57.92 66.92,61.92 66.92,65.92 65.92,79.92 67.92,15.92 68.92,25.92 67.92,27.92 68.92,29.92 67.92,31.92 68.92,33.92 67.92,35.92 68.92,37.92 67.92,39.92 68.92,41.92 67.92,43.92 68.92,45.92 67.92,47.92 68.92,53.92 67.92,55.92 68.92,57.92 67.92,59.92 68.92,61.92 68.92,65.92 67.92,67.92 67.92,79.92 69.92,15.92 70.92,25.92 69.92,27.92 70.92,29.92 69.92,31.92 70.92,33.92 69.92,35.92 70.92,37.92 69.92,39.92 70.92,41.92 69.92,43.92 70.92,45.92 69.92,47.92 70.92,49.92 69.92,51.92 70.92,53.92 69.92,55.92 70.92,57.92 69.92,59.92 70.92,61.92 69.92,63.92 69.92,79.92 71.92,15.92 72.92,17.92 72.92,25.92 71.92,27.92 72.92,29.92 71.92,31.92 72.92,33.92 71.92,35.92 72.92,37.92 71.92,39.92 72.92,41.92 71.92,43.92 72.92,49.92 71.92,51.92 72.92,53.92 71.92,55.92 72.92,57.92 71.92,59.92 72.92,61.92 71.92,63.92 71.92,79.92 73.92,15.92 74.92,17.92 74.92,25.92 73.92,27.92 74.92,29.92 73.92,31.92 74.92,33.92 73.92,35.92 74.92,37.92 73.92,39.92 74.92,41.92 73.92,43.92 74.92,45.92 73.92,47.92 74.92,49.92 73.92,51.92 74.92,53.92 73.92,55.92 74.92,57.92 73.92,59.92 74.92,61.92 73.92,63.92 74.92,73.92 73.92,75.92 74.92,77.92 73.92,79.92 76.92,9.92 75.92,23.92 75.92,27.92 75.92,31.92 75.92,35.92 75.92,39.92 75.92,47.92 75.92,51.92 75.92,55.92 75.92,59.92 76.92,69.92 75.92,79.92 76.92,81.92 76.92,85.92 78.92,1.92 77.92,3.92 78.92,5.92 77.92,7.92 78.92,9.92 78.92,69.92 77.92,79.92 78.92,81.92 77.92,83.92 78.92,85.92 77.92,87.92 80.92,1.92 79.92,3.92 80.92,5.92 79.92,7.92 80.92,9.92 79.92,11.92 80.92,13.92 80.92,69.92 79.92,79.92 80.92,81.92 79.92,83.92 80.92,85.92 79.92,87.92 82.92,1.92 81.92,3.92 82.92,5.92 81.92,7.92 82.92,9.92 81.92,11.92 82.92,13.92 81.92,15.92 82.92,17.92 81.92,19.92 82.92,21.92 81.92,23.92 82.92,25.92 81.92,27.92 82.92,29.92 81.92,31.92 82.92,37.92 81.92,39.92 82.92,41.92 81.92,43.92 82.92,45.92 81.92,47.92 82.92,49.92 81.92,51.92 82.92,53.92 81.92,55.92 82.92,57.92 81.92,59.92 82.92,61.92 81.92,63.92 82.92,65.92 81.92,79.92 82.92,81.92 81.92,83.92 82.92,85.92 81.92,87.92 84.92,1.92 83.92,3.92 84.92,5.92 83.92,7.92 84.92,9.92 83.92,11.92 84.92,13.92 83.92,15.92 84.92,17.92 83.92,19.92 83.92,23.92 83.92,27.92 83.92,35.92 83.92,39.92 83.92,43.92 83.92,47.92 83.92,51.92 83.92,55.92 83.92,59.92 83.92,71.92 84.92,73.92 84.92,77.92 83.92,79.92 84.92,81.92 83.92,83.92 84.92,85.92 83.92,87.92 86.92,1.92 85.92,3.92 85.92,7.92 86.92,9.92 85.92,11.92 86.92,13.92 85.92,15.92 86.92,17.92 85.92,71.92 86.92,73.92 85.92,75.92 86.92,77.92 85.92,79.92 86.92,81.92 85.92,83.92 85.92,87.92 88.92,9.92 87.92,11.92 88.92,13.92 87.92,15.92 88.92,17.92 87.92,71.92 88.92,73.92 87.92,75.92 88.92,77.92 87.92,79.92 90.92,9.92 89.92,11.92 90.92,13.92 89.92,15.92 90.92,17.92 89.92,19.92 90.92,21.92 89.92,23.92 90.92,25.92 89.92,27.92 90.92,29.92 89.92,31.92 90.92,33.92 89.92,35.92 90.92,37.92 89.92,39.92 90.92,41.92 89.92,43.92 90.92,45.92 89.92,47.92 90.92,49.92 89.92,51.92 90.92,53.92 89.92,55.92 90.92,57.92 89.92,59.92 90.92,61.92 89.92,63.92 90.92,65.92 89.92,67.92 90.92,69.92 89.92,71.92 90.92,73.92 89.92,75.92 90.92,77.92 89.92,79.92 92.92,9.92 91.92,11.92 92.92,13.92 91.92,15.92 92.92,17.92 91.92,19.92 92.92,21.92 91.92,23.92 92.92,25.92 91.92,27.92 92.92,29.92 91.92,31.92 92.92,33.92 91.92,35.92 92.92,37.92 91.92,39.92 92.92,41.92 91.92,43.92 92.92,45.92 91.92,47.92 92.92,49.92 91.92,51.92 92.92,53.92 91.92,55.92 92.92,57.92 91.92,59.92 92.92,61.92 91.92,63.92 92.92,65.92 91.92,67.92 92.92,69.92 91.92,71.92 92.92,73.92 91.92,75.92 92.92,77.92 91.92,79.92 93.92,11.92 93.92,15.92 93.92,19.92 93.92,23.92 93.92,27.92 93.92,31.92 93.92,35.92 93.92,39.92 93.92,43.92 93.92,47.92 93.92,51.92 93.92,55.92 93.92,59.92 93.92,63.92 93.92,67.92 93.92,71.92 93.92,75.92 93.92,79.92 53,65 53,64 54,65 55,65 55,64 54,64 53.5,63 54.5,63 54.5,62 53.5,62 53.5,61 54.5,61 54.5,60 53.5,60 53.5,59 54.5,59 53.5,58 55.5,58 54.5,58 54.5,57 53.5,57 55.5,57 56.5,58 52.5,57 52.5,58 51.5,58 51.5,57 50.5,57 50.5,58 49.5,58 49.5,57 67,22 68,22 68,21 69,22 69,23 68,23 67,23 66,23 69,24 37,24 37,22 38,22 38,21 39,22 39,23 38,23 37,23 36,23 39,24 38,24 36,24 68.5,17 69.5,17 70.5,17 71.5,17 70,18 71,18 72,18 65,17 39.92,17.92 39.92,16.92 40.92,16.92 40.92,15.92 38.42,16.92 38.92,15.92 34.92,16.92 34.92,15.92 39.92,14.92 38.92,14.92 37.92,14.92 36.92,14.92 35.92,14.92 34.92,14.92 33.92,14.92 68,24 67,24 66,24
  pour Top (isolate 0.61, rank 6): 0,0 0,90.81 93.98,90.81 95.89,90.81 95.89,0
  pour Route2 (isolate 0.61): 0,0 0,90.81 95.89,90.81 95.89,0
  pour Route15 (isolate 0.61): 0,0 0,90.81 95.89,90.81 95.89,0
  pour Bottom (isolate 0.61, no thermals): 0,0 0,90.81 93.98,90.81 95.89,90.81 95.89,0
  pour Top (isolate 0.254, rank 6): 66,51.75 40.25,51.75 40.25,67.75 66,67.75
  pour Top (isolate 0.254, rank 6): 44.65,14.9 44.65,38.45 18,38.45 18,14.9
  pour Top (isolate 0.254, rank 6): 74.65,14.9 74.65,37.45 48,37.45 48,14.9
GPIO12  (via drill 0.35)
  Top 0.254: U1.3 56.8,61 v56.9,61.1
  Route2 0.254: v56.9,61.1 58.4,61.1 82.4,37.1 82.4,32.8 84.08,31.11 JP2.31
N$3
  Top 0.256: U2.6 33.4,19.25 C18.1
N$4
  pour Top (isolate 0.254, no thermals): 37.5,19.6 37.5,19.9 31.6,25.8 29.3,25.8 29.3,23.6 32.7,20.2 34.4,20.2 34.4,19.6
N$6
  Top 0.256: U2.7 35.25,18.75 33.97,17.47 C20.1
N$10
  Top 0.256: U3.6 63.4,19.25 C19.1
N$11
  pour Top (isolate 0.254, no thermals): 67.5,19.6 67.5,19.9 61.6,25.8 59.3,25.8 59.3,23.6 62.7,20.2 64.4,20.2 64.4,19.6
N$12
  Top 0.256: U3.7 65.25,18.75 63.97,17.47 C21.1
N$18
  Top 0.256: R7.2 58.75,63.5 57.85,62.6 U1.5
N$19
  Top 0.256: R8.1 43.15,64.1 C2.1
N$20
  Top 0.256: U1.7 51.2,61.8 51,62 51,63.75 50.7,64.05 C3.1 47.2,64.05 R8.2
N$21
  Top 0.256: U1.4 59.3,61.8 60.25,62.75 60.25,66.25 59.75,66.75 58.8,66.75 C1.1
SW  (via drill 0.35)
  Top 0.152: v46,57.5 D1.P$1
  Top 0.406: C4.2 57.75,57.45 v57.75,57.5
  Top 2: D1.P$1 46,57.3 36.25,57.3 L1.P$1 36,54 43.5,54
  Route15 1.016: v57.75,57.5 56.05,55.8 47.7,55.8 v46,57.5
  pour Top (isolate 0.254, no thermals): 48.5,51.75 48.5,59.4 52.7,59.4 52.7,60.45 33.25,60.45 33.25,51.75

### Text on the board
tPlace: JLCJLCJLC | 12V | 5V | 3.3V
tNames: REV D | PWR